# Altium schematic sheet LCD Connector.SchDoc
size Tabloid
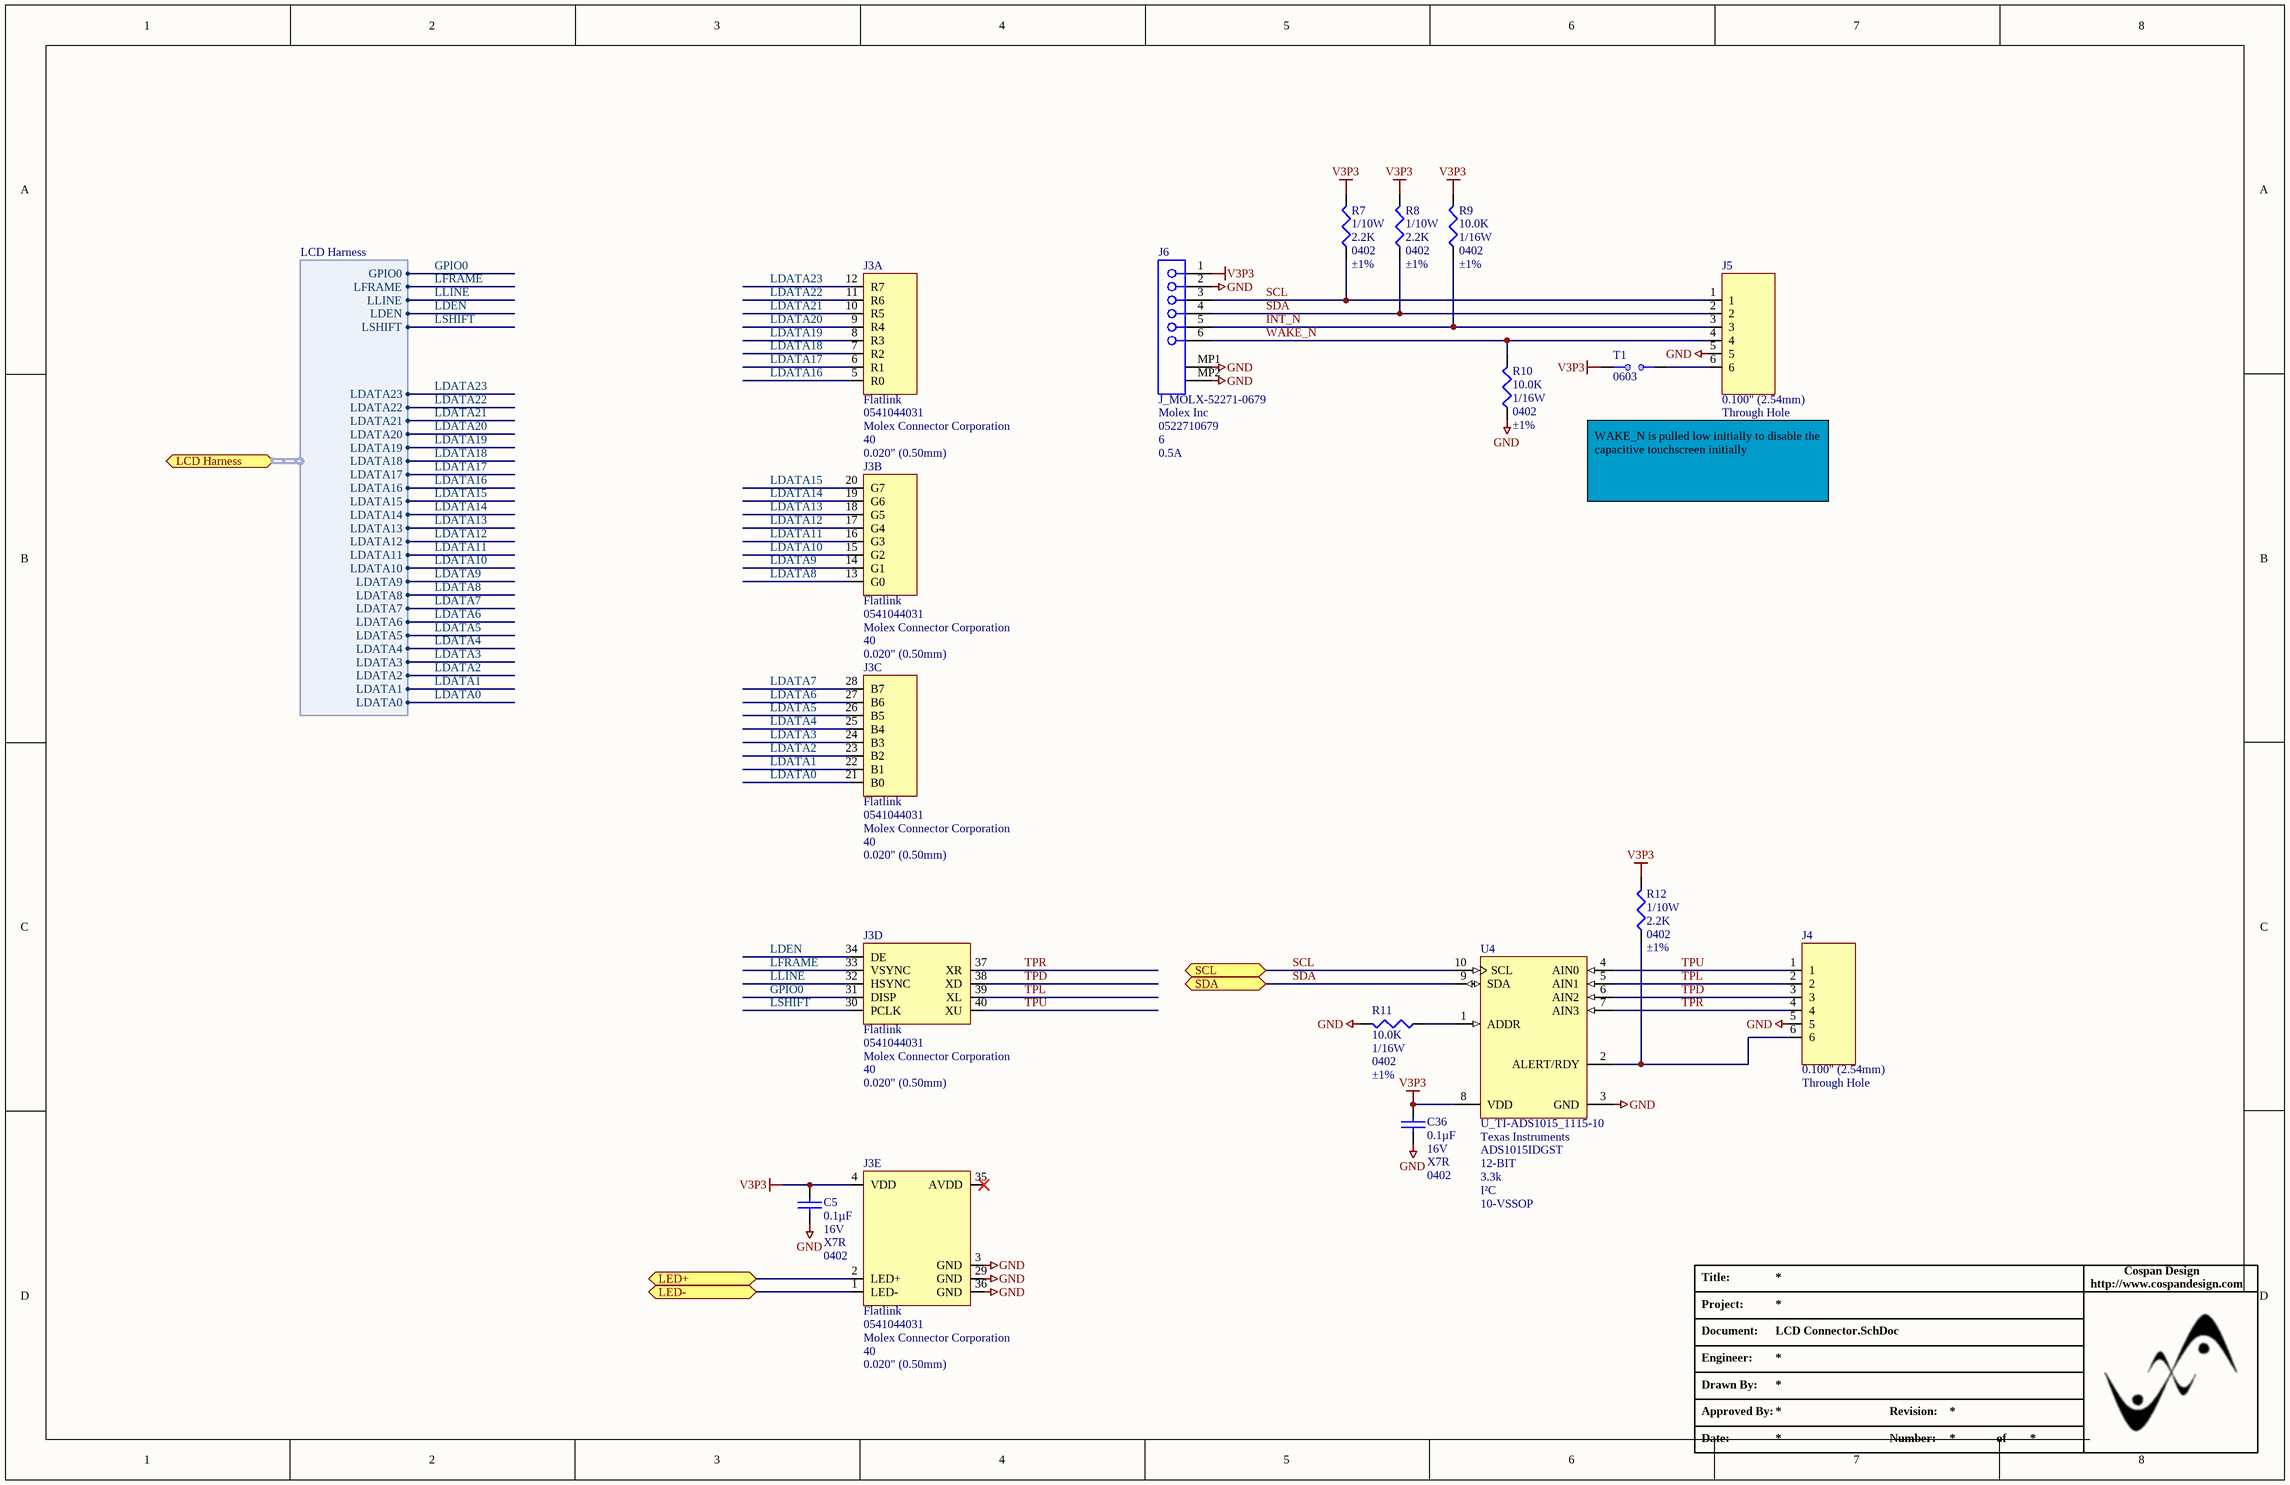
[diagram p0: LCD Connector.SchDoc]

## Parts
C5  Capacitance: 0.1µF  Voltage - Rated: 16V  Temperature Coefficient: X7R  Package / Case: 0402  [C_0402]  (hidden comment: 0.1uF)
C36  Capacitance: 0.1µF  Voltage - Rated: 16V  Temperature Coefficient: X7R  Package / Case: 0402  [C_0402]  (hidden comment: 0.1uF)
J3  Flatlink  Manufacturer Part Number: 0541044031  Manufacturer: Molex Connector Corporation  Number of Positions: 40  Pitch: 0.020" (0.50mm)  [FPC_40PIN]  (parts A,B,C,D,E of 5)
J4  Pitch: 0.100" (2.54mm)  Mounting Type: Through Hole  [HDR_1X6 - FEMALE]  (hidden comment: J_HDR1X6_THRHOLE_VERT_FEMALE)
J5  Pitch: 0.100" (2.54mm)  Mounting Type: Through Hole  [HDR_1X6]  (hidden comment: J_HDR1X6_THRHOLE_VERT)
J6  J_MOLX-52271-0679  Manufacturer: Molex Inc  Manufacturer Part Number: 0522710679  Number of Positions: 6  Current Rating: 0.5A  [MOLX-52271-0679]
R7  Power (Watts): 1/10W  Resistance In Ohms: 2.2K  Case: 0402  Tolerance: ±1%  [R_0402]  (hidden comment: 2.2k Ohms)
R8  Power (Watts): 1/10W  Resistance In Ohms: 2.2K  Case: 0402  Tolerance: ±1%  [R_0402]  (hidden comment: 2.2k Ohms)
R9  Resistance In Ohms: 10.0K  Power (Watts): 1/16W  Case: 0402  Tolerance: ±1%  [R_0402]  (hidden comment: R_0402_10.0K)
R10  Resistance In Ohms: 10.0K  Power (Watts): 1/16W  Case: 0402  Tolerance: ±1%  [R_0402]  (hidden comment: R_0402_10.0K)
R11  Resistance In Ohms: 10.0K  Power (Watts): 1/16W  Case: 0402  Tolerance: ±1%  [R_0402]  (hidden comment: R_0402_10.0K)
R12  Power (Watts): 1/10W  Resistance In Ohms: 2.2K  Case: 0402  Tolerance: ±1%  [R_0402]  (hidden comment: 2.2k Ohms)
T1  Case: 0603  [ERA-0603-SOLDER_JUMPER]  (hidden comment: Place Solder Bridge to Enable)  (no BOM)
U4  U_TI-ADS1015_1115-10  Manufacturer: Texas Instruments  Manufacturer Part Number: ADS1015IDGST  Number of Bits: 12-BIT  Sampling Rate (Per Second): 3.3k  Data Interface: I²C  Supplier Device Package: 10-VSSOP  [TI-DGS10_L]

## Ports
LCD Harness (harness LCD Harness), LED+, LED-, SCL, SDA

## Harnesses
LCD Harness: GPIO0, LFRAME, LLINE, LDEN, LSHIFT, LDATA0, LDATA1, LDATA2, LDATA3, LDATA4, LDATA5, LDATA6, LDATA7, LDATA8, LDATA9, LDATA10, LDATA11, LDATA12, LDATA13, LDATA14, LDATA15, LDATA16, LDATA17, LDATA18, LDATA19, LDATA20, LDATA21, LDATA22, LDATA23

## Nets
GND: C5.1 C36.1 J3.3(GND) J3.29(GND) J3.36(GND) J4.5 J5.5 J6.2 J6.MP1 J6.MP2 R10.2 R11.1 U4.3(GND)
V3P3: C5.2 C36.2 J3.4(VDD) J6.1 R7.1 R8.1 R9.1 R12.1 T1.1 U4.8(VDD)
GPIO0: J3.31(DISP) ; port LCD Harness.GPIO0
INT_N: J5.3 J6.5 R9.2
LDATA0: J3.21(B0) ; port LCD Harness.LDATA0
LDATA1: J3.22(B1) ; port LCD Harness.LDATA1
LDATA2: J3.23(B2) ; port LCD Harness.LDATA2
LDATA3: J3.24(B3) ; port LCD Harness.LDATA3
LDATA4: J3.25(B4) ; port LCD Harness.LDATA4
LDATA5: J3.26(B5) ; port LCD Harness.LDATA5
LDATA6: J3.27(B6) ; port LCD Harness.LDATA6
LDATA7: J3.28(B7) ; port LCD Harness.LDATA7
LDATA8: J3.13(G0) ; port LCD Harness.LDATA8
LDATA9: J3.14(G1) ; port LCD Harness.LDATA9
LDATA10: J3.15(G2) ; port LCD Harness.LDATA10
LDATA11: J3.16(G3) ; port LCD Harness.LDATA11
LDATA12: J3.17(G4) ; port LCD Harness.LDATA12
LDATA13: J3.18(G5) ; port LCD Harness.LDATA13
LDATA14: J3.19(G6) ; port LCD Harness.LDATA14
LDATA15: J3.20(G7) ; port LCD Harness.LDATA15
LDATA16: J3.5(R0) ; port LCD Harness.LDATA16
LDATA17: J3.6(R1) ; port LCD Harness.LDATA17
LDATA18: J3.7(R2) ; port LCD Harness.LDATA18
LDATA19: J3.8(R3) ; port LCD Harness.LDATA19
LDATA20: J3.9(R4) ; port LCD Harness.LDATA20
LDATA21: J3.10(R5) ; port LCD Harness.LDATA21
LDATA22: J3.11(R6) ; port LCD Harness.LDATA22
LDATA23: J3.12(R7) ; port LCD Harness.LDATA23
LDEN: J3.34(DE) ; port LCD Harness.LDEN
LED+: J3.2(LED+) ; port LED+
LED-: J3.1(LED-) ; port LED-
LFRAME: J3.33(VSYNC) ; port LCD Harness.LFRAME
LLINE: J3.32(HSYNC) ; port LCD Harness.LLINE
LSHIFT: J3.30(PCLK) ; port LCD Harness.LSHIFT
SCL: J5.1 J6.3 R7.2 U4.10(SCL) ; port SCL
SDA: J5.2 J6.4 R8.2 U4.9(SDA) ; port SDA
TPD: J3.38(XD) J4.3 U4.6(AIN2)
TPL: J3.39(XL) J4.2 U4.5(AIN1)
TPR: J3.37(XR) J4.4 U4.7(AIN3)
TPU: J3.40(XU) J4.1 U4.4(AIN0)
WAKE_N: J5.4 J6.6 R10.1
NetJ4_6: J4.6 R12.2 U4.2(ALERT/RDY)
NetJ5_6: J5.6 T1.2
NetR11_2: R11.2 U4.1(ADDR)

Not connected (* = marked no-connect by the designer): J3 35(AVDD)*

## Notes on the sheet
- WAKE_N is pulled low initially to disable the capacitive touchscreen initially
- Title:
- http://www.cospandesign.com
- Cospan Design
- Project:
- Document:
- Engineer:
- Drawn By:
- Approved By:
- Revision:
- Date:
- Number:
- of

## Library data of the parts
C5 C36 = C_0402_0.1UF_16V: CAP CER .10UF 16V X7R 0402; Manufacturer: TDK Corporation; Manufacturer Part Number: C1005X7R1C104K; Tolerance: ±10%; Supplier 1: Digi-Key; Supplier Part Number 1: 445-4952-1-ND; RoHS: RoHS Compliant; Category: Capacitors; Stock 1: 230800; Pricing: 10=0.024, 100=0.0143, 500=0.00826, 1000=0.00572 (USD); Mounting Type: Surface Mount, MLCC; Features: General Purpose; Lead Spacing: -; Thickness: 0.50mm; Packaging: Cut Tape (CT); ComponentLink1URL: http://www.tdk.co.jp/tefe02/e412_c.pdf; ComponentLink1Description: http://www.tdk.co.jp/tefe02/e412_c.pdf; Operating Temperature: -55°C ~ 125°C; COST_1: *; COST_100: *; COST_1000: *; MANF1: *; MANF1_PN: *; MANF2: *; MANF2_PN: *; MANF3: *; MANF3_PN: *; VENDOR1: *; VENDOR1_PN: *
J3 = J_FPC_MOLEX_40POS_TOP: CONN FFC/FPC .50MM 40POS R/A SMD; Flat Flex Type: FFC, FPC; Connector/Contact Type: Contacts, Top; FFC, FCB Thickness: 0.30mm; Locking Feature: Slide Lock; Cable End Type: Straight, Tapered; Actuator Material: Polyphenylene Sulfide (PPS), Glass Filled; Voltage Rating: 50V; Material Flammability Rating: UL94 V-0; Current Rating: 0.5A; Supplier 1: Digi-Key; Supplier Part Number 1: WM3431CT-ND; RoHS: RoHS Compliant; Category: Connectors, Interconnects; Stock 1: 5388; Pricing: 1=2.8, 10=2.686, 25=2.4624, 50=2.3506, 100=2.2387, 250=1.95888, 500=1.90292 (USD); Packaging: Cut Tape (CT); Mounting Type: Surface Mount, Right Angle; Termination: Solder; Height Above Board: 0.079" (2.00mm); Contact Material: Phosphor Bronze; Contact Finish: Gold; Housing Material: Polyamide (PA46), Nylon 4/6, Glass Filled; Features: Solder Retention, Zero Insertion Force (ZIF); Operating Temperature: -20°C ~ 85°C; ComponentLink1URL: http://www.molex.com/pdm_docs/sd/541044031_sd.pdf; ComponentLink1Description: http://www.molex.com/pdm_docs/sd/541044031_sd.pdf
J4 = J_HDR1X6_THRHOLE_VERT_FEMALE: CONN HEADER FEMALE 6POS .1" TIN; Manufacturer: Samtec; Manufacturer Part Number: SSW-106-01-T-S; Number of Positions: 6; Number of Positions Loaded: All; Supplier 1: Samtec; Supplier Part Number 1: SSW-106-01-T-S; Category: Connectors, Interconnects; Connector Type: Header; Contact Type: Female Socket; Number of Rows: 1; Termination: Solder; Contact Finish: Tin; Contact Finish Thickness: -; Color: Black; ComponentLink1URL: http://www.sullinscorp.com/drawings/101_xPxCxxxLFBN-RC,_10492-D.pdf; ComponentLink1Description: http://www.sullinscorp.com/drawings/101_xPxCxxxLFBN-RC,_10492-D.pdf; Pricing: 0.373; COST_1: *; COST_100: *; COST_1000: *; MANF1: *; MANF1_PN: *; MANF2: *; MANF2_PN: *; MANF3: *; MANF3_PN: *; VENDOR1: *; VENDOR1_PN: *
J5 = J_HDR1X6_THRHOLE_VERT: CONN HEADER .100" 12POS TIN PCB; Manufacturer: Samtec; Manufacturer Part Number: TSW-106-07-T-S; Connector Type: Unshrouded; Number of Positions: 6; Number of Positions Loaded: All; Supplier 1: Samtec; Supplier Part Number 1: TSW-106-07-T-S; RoHS: RoHS Compliant; Category: Connectors, Interconnects; Stock 1: 0; Number of Rows: 1; Row Spacing: -; Height Stacking (Mating): -; Height Above Board: 0.100" (2.54mm); Contact Mating Length: 0.166" (4.22mm); Termination: Solder; Contact Finish: Tin; Contact Finish Thickness: 200µin (5.08µm); Features: -; Color: Black; Packaging: Bulk; ComponentLink1URL: http://www.samtec.com/ftppub/cpdf/TX-MKT1.PDF; ComponentLink1Description: http://www.samtec.com/ftppub/cpdf/TX-MKT1.PDF; Molding Height Above Board: 0.100" (2.54mm); ComponentLink2URL: http://www.samtec.com/ftppub/pdf/TD.PDF; ComponentLink2Description: http://www.samtec.com/ftppub/pdf/TD.PDF; Pricing: 1=0.201
J6 = J_MOLX-52271-0679: CONN FFC 6POS 1MM R/A ZIF SMD; Flat Flex Type: FPC; Connector/Contact Type: Contacts, Bottom; Pitch: 0.039" (1.00mm); FFC, FCB Thickness: 0.30mm; Locking Feature: Slide Lock; Cable End Type: Tapered; Actuator Material: Polyphenylene Sulfide (PPS); Voltage Rating: 50V; Material Flammability Rating: UL94 V-0; Supplier 1: Digi-Key; Supplier Part Number 1: WM7955CT-ND; RoHS: RoHS Compliant; Category: Connectors, Interconnects; Stock 1: 8200; Pricing: 1=1.39, 10=1.219, 25=1.1472, 50=1.0992, 100=1.0515, 250=0.95592, 500=0.86032 (USD); Packaging: Cut Tape (CT); Mounting Type: Surface Mount, Right Angle; Termination: Solder; Height Above Board: 0.118" (3.00mm); Contact Material: Phosphor Bronze; Contact Finish: Tin Bismuth; Housing Material: Polyamide (PA46), Nylon 4/6; Features: Solder Retention, Zero Insertion Force (ZIF); Operating Temperature: -40°C ~ 85°C; ComponentLink1URL: http://www.molex.com/pdm_docs/sd/522710479_sd.pdf; ComponentLink1Description: http://www.molex.com/pdm_docs/sd/522710479_sd.pdf
R7 R8 R12 = R_0402_2.2K: RES 2.20K OHM 1/10W 1% 0402 SMD; Manufacturer: Yageo; Manufacturer Part Number: RC0402FR-072K2L; Temperature Coefficient: ±100ppm/°C; Supplier 1: Digi-Key; Supplier Part Number 1: 311-2.20KLRCT-ND; RoHS: RoHS Compliant; Category: Resistors; Stock 1: 0; Pricing: 10=0.014, 100=0.0063, 500=0.00382, 1000=0.0027, 5000=0.00203 (USD); Resistance (Ohms): 2.2K; Composition: Thick Film; Features: -; Package / Case: 0402 (1005 Metric); Size / Dimension: 0.039" L x 0.020" W (1.00mm x 0.50mm); Height: 0.016" (0.40mm); Number of Terminations: 2; Packaging: Cut Tape (CT); ComponentLink1URL: http://www.yageo.com/documents/recent/PYu-RC0402_51_RoHS_L_6.pdf; ComponentLink1Description: http://www.yageo.com/documents/recent/PYu-RC0402_51_RoHS_L_6.pdf; Supplier 2: Digi-Key; Supplier Part Number 2: RMCF0402FT2K20CT-ND; Stock 2: 39712; ComponentLink2URL: http://www.seielect.com/Catalog/SEI-RMCF_RMCP.pdf; ComponentLink2Description: http://www.seielect.com/Catalog/SEI-RMCF_RMCP.pdf
R9-R11 = R_0402_10.0K: RES 10.0K OHM 1/16W 1% 0402 SMD; Manufacturer: Stackpole Electronics Inc; Manufacturer Part Number: RMCF0402FT10K0; Resistance (Ohms): 10k; Temperature Coefficient: ±100ppm/°C; Supplier 1: Digi-Key; Supplier Part Number 1: RMCF0402FT10K0CT-ND; RoHS: RoHS Compliant; Category: Resistors; Stock 1: 234525; Pricing: 1=0.04, 10=0.025, 50=0.0138, 100=0.0105, 250=0.0078, 500=0.00576, 1000=0.00384, 2500=0.00324, 5000=0.0027 (USD); Composition: Thick Film; Features: -; Package / Case: 0402 (1005 Metric); Size / Dimension: 0.039" L x 0.020" W (1.00mm x 0.50mm); Height: 0.016" (0.40mm); Number of Terminations: 2; Packaging: Cut Tape (CT); ComponentLink1URL: http://www.seielect.com/Catalog/SEI-RMCF_RMCP.pdf; ComponentLink1Description: http://www.seielect.com/Catalog/SEI-RMCF_RMCP.pdf
T1 = T_0603_JUMPER_PAD: SOLDER_JUMPER PAD
U4 = U_TI-ADS1015_1115-10: IC ADC 12BIT I2C W/REF 10-MSOP; Number of Inputs: 2, 4; Input Type: Differential, Single Ended; Configuration: MUX-PGA-ADC; Ratio - S/H:ADC: 1:1; Number of A/D Converters: 1; Architecture: Sigma-Delta; Reference Type: Internal; Voltage - Supply, Analog: 2 V ~ 5.5 V; Supplier 1: Digi-Key; RoHS: RoHS Compliant; Category: Integrated Circuits (ICs); Stock 1: 1516; Pricing 1: 1=3.42, 10=3.065, 25=2.756, 100=2.5067 (USD); Packaging: Cut Tape (CT); Voltage - Supply, Digital: 2 V ~ 5.5 V; Features: PGA; Operating Temperature: -40°C ~ 125°C; Package / Case: 10-TFSOP, 10-MSOP (0.118", 3.00mm Width); ComponentLink1URL: http://www.ti.com/lit/ds/symlink/ads1013.pdf; ComponentLink1Description: http://www.ti.com/lit/ds/symlink/ads1013.pdf; Supplier Part Number 1: 296-25227-1-ND